# Altium project PART4 - TEST_BOARD.PrjPcb
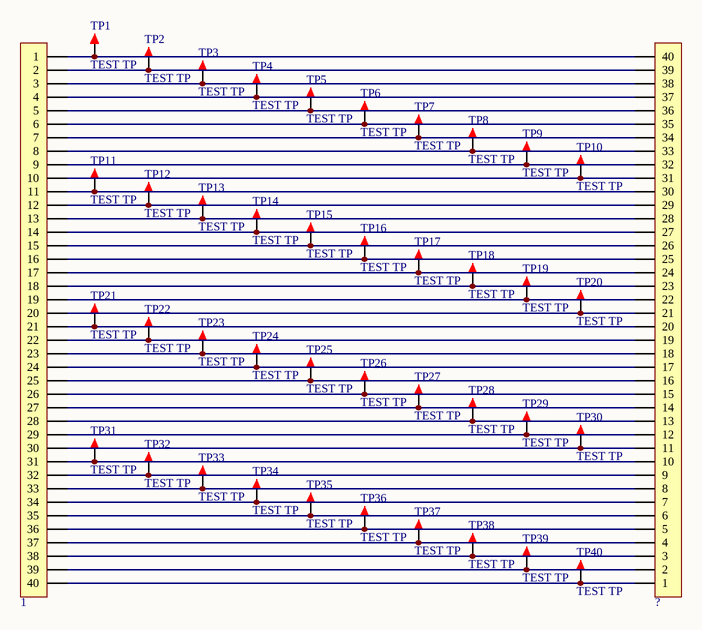
[diagram p0: TEST_BOARD.SchDoc]
1 sheet, 42 parts. Net scope: global (net labels, ports and power ports of the same name join across sheets).
Board file: TEST_BOEAD.PcbDoc

## Sheet TEST_BOARD.SchDoc
size A4; SheetNumber: 1; SheetTotal: 1

### Parts
1  FPC1.0-40P  [FPC0.5 2H-WS-40P]  (value not drawn)
?  FPC1.0-40P  [FPC0.5 2H-WS-40P]  (value not drawn)
TP1  TEST TP  [TEST TP1.4_B]
TP2  TEST TP  [TEST TP1.4_B]
TP3  TEST TP  [TEST TP1.4_B]
TP4  TEST TP  [TEST TP1.4_B]
TP5  TEST TP  [TEST TP1.4_B]
TP6  TEST TP  [TEST TP1.4_B]
TP7  TEST TP  [TEST TP1.4_B]
TP8  TEST TP  [TEST TP1.4_B]
TP9  TEST TP  [TEST TP1.4_B]
TP10  TEST TP  [TEST TP1.4_B]
TP11  TEST TP  [TEST TP1.4_B]
TP12  TEST TP  [TEST TP1.4_B]
TP13  TEST TP  [TEST TP1.4_B]
TP14  TEST TP  [TEST TP1.4_B]
TP15  TEST TP  [TEST TP1.4_B]
TP16  TEST TP  [TEST TP1.4_B]
TP17  TEST TP  [TEST TP1.4_B]
TP18  TEST TP  [TEST TP1.4_B]
TP19  TEST TP  [TEST TP1.4_B]
TP20  TEST TP  [TEST TP1.4_B]
TP21  TEST TP  [TEST TP1.4_B]
TP22  TEST TP  [TEST TP1.4_B]
TP23  TEST TP  [TEST TP1.4_B]
TP24  TEST TP  [TEST TP1.4_B]
TP25  TEST TP  [TEST TP1.4_B]
TP26  TEST TP  [TEST TP1.4_B]
TP27  TEST TP  [TEST TP1.4_B]
TP28  TEST TP  [TEST TP1.4_B]
TP29  TEST TP  [TEST TP1.4_B]
TP30  TEST TP  [TEST TP1.4_B]
TP31  TEST TP  [TEST TP1.4_B]
TP32  TEST TP  [TEST TP1.4_B]
TP33  TEST TP  [TEST TP1.4_B]
TP34  TEST TP  [TEST TP1.4_B]
TP35  TEST TP  [TEST TP1.4_B]
TP36  TEST TP  [TEST TP1.4_B]
TP37  TEST TP  [TEST TP1.4_B]
TP38  TEST TP  [TEST TP1.4_B]
TP39  TEST TP  [TEST TP1.4_B]
TP40  TEST TP  [TEST TP1.4_B]

### Nets
Net1_1: 1.1 ?.40 TP1.1
Net1_2: 1.2 ?.39 TP2.1
Net1_3: 1.3 ?.38 TP3.1
Net1_4: 1.4 ?.37 TP4.1
Net1_5: 1.5 ?.36 TP5.1
Net1_6: 1.6 ?.35 TP6.1
Net1_7: 1.7 ?.34 TP7.1
Net1_8: 1.8 ?.33 TP8.1
Net1_9: 1.9 ?.32 TP9.1
Net1_10: 1.10 ?.31 TP10.1
Net1_11: 1.11 ?.30 TP11.1
Net1_12: 1.12 ?.29 TP12.1
Net1_13: 1.13 ?.28 TP13.1
Net1_14: 1.14 ?.27 TP14.1
Net1_15: 1.15 ?.26 TP15.1
Net1_16: 1.16 ?.25 TP16.1
Net1_17: 1.17 ?.24 TP17.1
Net1_18: 1.18 ?.23 TP18.1
Net1_19: 1.19 ?.22 TP19.1
Net1_20: 1.20 ?.21 TP20.1
Net1_21: 1.21 ?.20 TP21.1
Net1_22: 1.22 ?.19 TP22.1
Net1_23: 1.23 ?.18 TP23.1
Net1_24: 1.24 ?.17 TP24.1
Net1_25: 1.25 ?.16 TP25.1
Net1_26: 1.26 ?.15 TP26.1
Net1_27: 1.27 ?.14 TP27.1
Net1_28: 1.28 ?.13 TP28.1
Net1_29: 1.29 ?.12 TP29.1
Net1_30: 1.30 ?.11 TP30.1
Net1_31: 1.31 ?.10 TP31.1
Net1_32: 1.32 ?.9 TP32.1
Net1_33: 1.33 ?.8 TP33.1
Net1_34: 1.34 ?.7 TP34.1
Net1_35: 1.35 ?.6 TP35.1
Net1_36: 1.36 ?.5 TP36.1
Net1_37: 1.37 ?.4 TP37.1
Net1_38: 1.38 ?.3 TP38.1
Net1_39: 1.39 ?.2 TP39.1
Net1_40: 1.40 ?.1 TP40.1

### Library data of the parts
1 ? = FPC-40P: FPC连接器; 版权归属: 源创客; BOM名称: FPC连接器; 学习资源: www.ooocke.com
TP1-TP40 = TEST TP: 测试环; 版权归属: 源创客; BOM名称: 测试环; 学习资源: www.ooocke.com